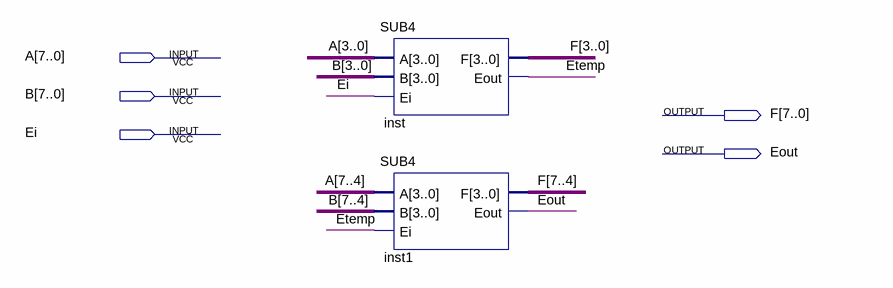
[diagram p0: schematic sheet]
// Quartus schematic SUB8.bdf as structural Verilog: 2 symbols, 5 pins
module SUB8 (
  input  [7:0] A,
  input  [7:0] B,
  input  Ei,
  output [7:0] F,
  output Eout
);

  wire Etemp;

  SUB4 inst (.A(A[3:0]), .B(B[3:0]), .Ei(Ei), .F(F[3:0]), .Eout(Etemp));
  SUB4 inst1 (.A(A[7:4]), .B(B[7:4]), .Ei(Etemp), .F(F[7:4]), .Eout(Eout));
endmodule
